# EAGLE design GPS Module (EAGLE 9.6.2)
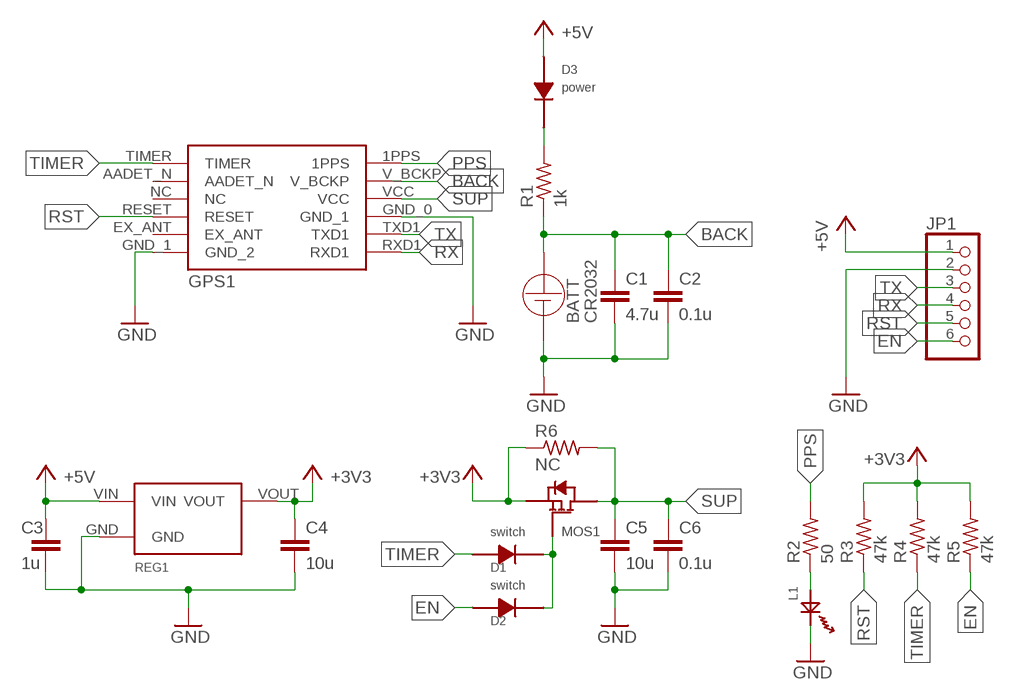
[diagram p0: schematic, sheet 1]

## Parts
BATT  CR2032  [CR2032]
C1  4.7u  C-EUC0603  [C0603]
C2  0.1u  C-EUC0603  [C0603]
C3  1u  C-EUC0603  [C0603]
C4  10u  C-EUC0603  [C0603]
C5  10u  C-EUC0603  [C0603]
C6  0.1u  C-EUC0603  [C0603]
D1  switch  1W4148W  [SOD-123]
D2  switch  1W4148W  [SOD-123]
D3  power  SS2040FL  [SOD-123FL]
GPS1  L80-M39  [L80]
JP1  PINHD-1X6  [1X06]
L1  OSXX1608C1A  [OSXX1608C1A]
MOS1  AO3401A  [SOT-23]
R1  1k  R-US_R0603  [R0603]
R2  50  R-US_R0805  [R0805]
R3  47k  R-US_R0805  [R0805]
R4  47k  R-US_R0805  [R0805]
R5  47k  R-US_R0805  [R0805]
R6  NC  R-US_R0603  [R0603]
REG1  AP7375  [SOT23]

## Nets
+3V3: C4.1 MOS1.S R3.2 R4.2 R5.2 R6.1 REG1.VOUT
+5V: C3.1 D3.C JP1.1 REG1.VIN
BACK: BATT.VCC BATT.VCC2(VCC) C1.1 C2.1 GPS1.V_BCKP R1.1
EN: D2.C JP1.6 R5.1
GND [gnd]: BATT.GND C1.2 C2.2 C3.2 C4.2 C5.2 C6.2 GPS1.GND_0(GND_1) GPS1.GND_1(GND_2) JP1.2 L1.CT REG1.GND
N$1: D3.A R1.2
N$2: D1.A D2.A MOS1.G
N$3: L1.AN R2.1
PPS: GPS1.1PPS R2.2
RST: GPS1.RESET JP1.5 R3.1
RX: GPS1.RXD1 JP1.4
SUP: C5.1 C6.1 GPS1.VCC MOS1.D R6.2
TIMER: D1.C GPS1.TIMER R4.1
TX: GPS1.TXD1 JP1.3
Unconnected: GPS1.AADET_N GPS1.EX_ANT GPS1.NC

## Library data of the parts
BATT = CR2032:CR2032
C1-C6 = rcl:C-EU: CAPACITOR, European symbol; SPICEPREFIX: C
D1 D2 = ChipDiodes:1W4148W
D3 = ChipDiodes:SS2040FL
GPS1 = GPS_L80:L80-M39
JP1 = pinhead:PINHD-1X6: PIN HEADER
L1 = Chip LED:OSXX1608C1A
MOS1 = AO3401A_PchMOS:AO3401A
R1-R6 = rcl:R-US_: RESISTOR, American symbol; SPICEPREFIX: R
REG1 = ChipLinearRegulator:AP7375

## Net classes
1 gnd: width 0.152 mm, clearance 0.152 mm

## Board
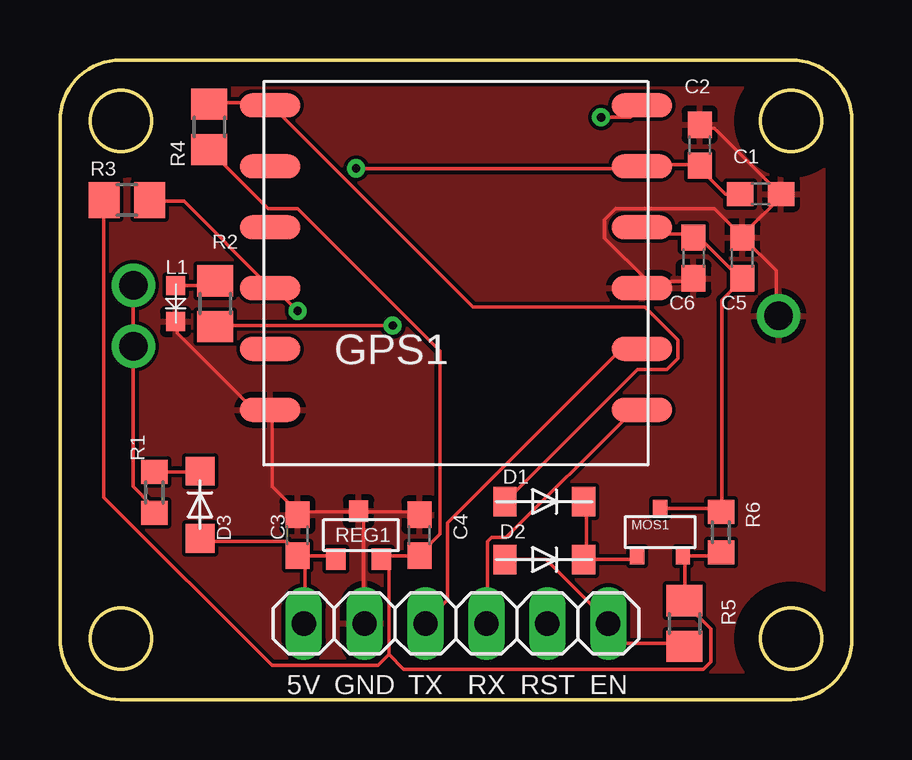
[diagram p1: board, top side]
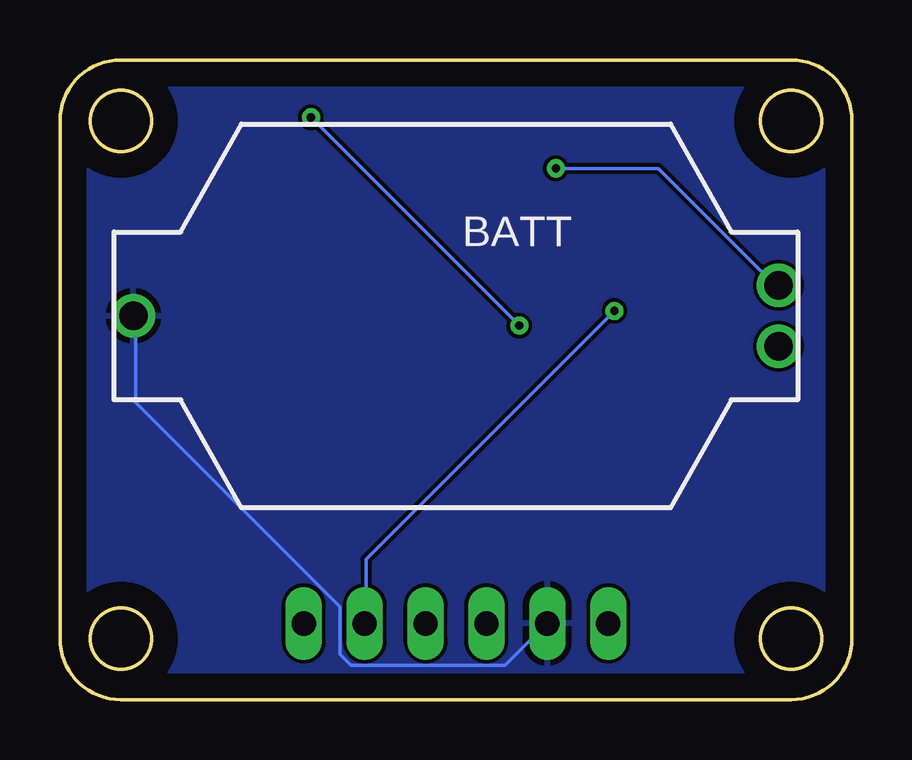
[diagram p2: board, bottom side, seen from below]

Size 33.02 x 26.67 mm. Coordinates in mm from the lower left corner, seen from the top.
Outline: 33.02,2.54 arc-90 30.48,0 2.54,0 arc-90 0,2.54 0,24.13 arc-90 2.54,26.67 30.48,26.67 arc-90 33.02,24.13 33.02,2.54
Outline: circle at 30.48,24.13 radius 1.27
Outline: circle at 30.48,2.54 radius 1.27
Outline: circle at 2.54,2.54 radius 1.27
Outline: circle at 2.54,24.13 radius 1.27
Copper layers (1*16): Top 0.035mm / dielectric 1.5mm / Bottom 0.035mm
Design rules "default": minimum track width 6mil, minimum drill 0.35mm, track to track 6mil, track to pad 6mil, pad to pad 6mil, via to via 6mil, smd to smd 6mil, copper to edge 40mil, drill to drill 6mil, minimum pad ring 10mil, minimum via ring 8mil, stop-mask expansion 4mil, vias tented up to drill 0mil, thermal gap 10mil

### Footprints (pad centres in the part's own frame; a part is rotated, then mirrored left to right if it is on the bottom)
CR2032 = drill 1.2: GND -13.45,0; VCC 13.45,-1.27; VCC2 13.45,1.27
C0603 = smd 1.1 x 1: 1 -0.85,0; 2 0.85,0
SOD-123 = smd 0.97 x 1.22: A 1.64,0; C -1.64,0
SOD-123FL = smd 1.2 x 1.2: A 1.4,0; C -1.4,0
L80 = smd 2.5 x 1: 1PPS 7.75,7; AADET_N -7.75,4.46; EX_ANT -7.75,-3.16; GND_0 -7.75,-5.7; GND_1 7.75,-0.62; NC -7.75,1.92; RESET -7.75,-0.62; RXD1 7.75,-5.7; TIMER -7.75,7; TXD1 7.75,-3.16; V_BCKP 7.75,4.46; VCC 7.75,1.92
1X06 = drill 1.016 long: 1 -6.35,0; 2 -3.81,0; 3 -1.27,0; 4 1.27,0; 5 3.81,0; 6 6.35,0
OSXX1608C1A = smd 0.8 x 0.8: AN -0.75,0; CT 0.75,0
SOT-23 = smd 0.6 x 0.7: D 0,1; G -0.95,-1; S 0.95,-1
R0603 = smd 1 x 1.1: 1 -0.85,0; 2 0.85,0
R0805 = smd 1.3 x 1.5: 1 -0.95,0; 2 0.95,0
SOT23 = smd 0.8 x 0.9: GND 0,1; VIN -0.95,-1; VOUT 0.95,-1

### Placement (x,y rotation side)
BATT  16.51,16 180 top
C1  29.21,21.08 0 top
C2  26.67,23.11 90 top
C3  9.91,6.86 90 top
C4  14.99,6.86 90 top
C5  28.45,18.41 90 top
C6  26.42,18.41 270 top
D1  20.19,8.26 0 top
D2  20.19,5.84 0 top
D3  5.84,8.13 90 top
GPS1  16.51,17.78 0 top
JP1  16.51,3.17 0 top
L1  4.83,16.51 270 top
MOS1  25.02,6.98 0 top
R1  3.94,8.64 90 top
R2  6.48,16.51 270 top
R3  2.79,20.83 180 top
R4  6.22,23.88 270 top
R5  26.04,3.17 90 top
R6  27.56,6.98 90 top
REG1  12.45,6.86 0 top

### Tracks (layer width: path | path; a pad name or v marks a point on that pad's centre or on a via)
+3V3
  Top 0.152: R6.1 27.43,5.99 26.06,5.99 MOS1.S 26.06,5.84 26.06,4.17 R5.2 26.06,4.01 27.13,2.95 27.13,1.57 26.82,1.27 14.33,1.27 13.72,1.88 | 13.72,5.99 14.94,5.99 C4.1 15.09,6.15 15.85,6.91 15.85,14.53 9.91,20.47 8.69,20.47 6.25,22.91 R4.2 | 13.72,5.99 13.41,5.99 REG1.VOUT 13.72,5.99 | 13.72,1.88 13.26,1.42 8.84,1.42 1.83,8.43 1.83,20.78 R3.2 | 13.72,5.99 13.72,1.88
+5V
  Top 0.152: 10.21,5.99 9.91,5.99 C3.1 | 10.21,5.99 11.43,5.99 REG1.VIN | D3.C 5.94,6.6 9.45,6.6 9.91,6.15 C3.1 | 10.21,5.99 10.21,3.25 JP1.1 | 10.21,5.99 C3.1
BACK  (via drill 0.35)
  Top 0.152: R1.1 3.81,7.82 3.81,8.13 3.05,8.89 3.05,14.68 BATT.VCC2 3.05,14.83 3.05,17.27 BATT.VCC | C1.1 27.74,21.08 26.67,22.15 C2.1 26.67,22.3 24.38,22.3 GPS1.V_BCKP 24.23,22.15 v12.34,22.15
  Bottom 0.152: v12.34,22.15 8.08,22.15 3.2,17.27 BATT.VCC
EN
  Top 0.152: D2.C 20.27,5.84 22.86,3.25 JP1.6 22.86,3.1 23.62,2.34 25.91,2.34 R5.1
GND
  Top 0.152: 24.54,17.42 26.36,17.42 C6.2 | 24.54,17.42 24.38,17.27 GPS1.GND_1 24.54,17.42 | C5.2 28.5,19.41 30.18,21.08 C1.2 30.02,21.08 27.28,23.82 26.67,23.82 C2.2 | 24.54,17.42 22.71,19.25 22.71,20.02 23.16,20.47 27.28,20.47 28.35,19.41 C5.2 | BATT.GND 29.87,16.05 29.87,17.88 28.5,19.25 C5.2 | L1.CT 4.88,15.75 4.88,15.29 8.08,12.09 8.69,12.09 GPS1.GND_0 8.84,11.94 8.84,8.89 9.91,7.82 | 12.65,7.82 14.94,7.82 C4.2 | 12.65,7.82 12.5,7.82 REG1.GND | 9.91,7.82 12.34,7.82 REG1.GND | 12.65,7.82 12.65,3.25 JP1.2 | 12.65,7.82 REG1.GND | 9.91,7.82 C3.2
  Bottom 0.152: BATT.GND 29.87,15.9 29.87,12.39 21.34,3.86 21.34,1.88 20.88,1.42 14.48,1.42 12.8,3.1 JP1.2
  pour Bottom: -1.27,27.94 34.29,27.94 34.29,-1.27 -1.27,-1.27
  pour Top: -1.27,27.94 34.29,27.94 34.29,-1.27 -1.27,-1.27
N$1
  Top 0.152: R1.2 3.96,9.5 5.79,9.5 D3.A
N$2
  Top 0.152: 21.95,5.84 23.93,5.84 MOS1.G | 21.95,5.84 21.95,8.13 D1.A | 21.95,5.84 D2.A
N$3
  Top 0.152: L1.AN 4.88,17.27 6.25,17.27 6.4,17.42 R2.1
PPS  (via drill 0.35)
  Top 0.152: v13.87,15.6 6.55,15.6 R2.2 | v22.55,24.28 23.77,24.28 24.23,24.74 GPS1.1PPS
  Bottom 0.152: v22.55,24.28 v13.87,15.6
RST  (via drill 0.35)
  Top 0.152: R3.1 3.81,20.78 5.18,20.78 8.69,17.27 GPS1.RESET 8.84,17.27 v9.91,16.21
  Bottom 0.152: v9.91,16.21 20.27,5.84 20.27,3.25 JP1.5
RX
  Top 0.152: GPS1.RXD1 24.23,11.94 23.77,11.94 18.59,6.76 17.98,6.76 17.83,6.6 17.83,3.25 JP1.4
SUP
  Top 0.152: MOS1.D 25.15,7.98 27.43,7.98 R6.2 27.58,7.98 27.58,16.66 28.35,17.42 C5.1 28.35,17.58 26.52,19.41 C6.1 26.36,19.41 24.54,19.41 24.38,19.56 GPS1.VCC
TIMER
  Top 0.152: D1.C 18.59,8.28 24.08,13.77 25.3,13.77 25.76,14.22 25.76,14.99 24.38,16.36 17.22,16.36 8.84,24.74 GPS1.TIMER 8.69,24.89 6.25,24.89 R4.1
TX
  Top 0.152: GPS1.TXD1 24.23,14.53 23.32,14.53 16.15,7.37 16.15,4.17 15.24,3.25 JP1.3

### Text on the board
tPlace: 5V | GND | TX | RX | RST | EN